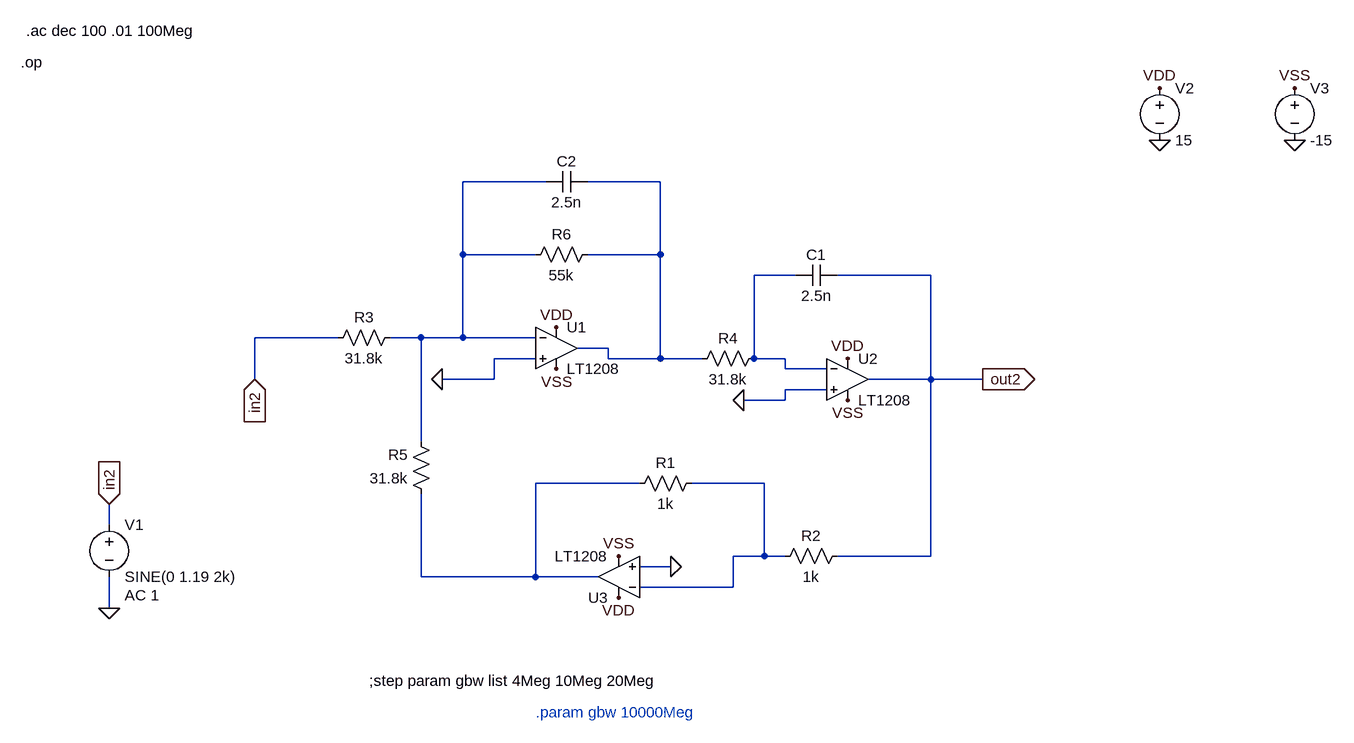
[diagram p0: schematic Etaj2.asc]
Etaj2.asc, the LTspice schematic file:
Version 4
SHEET 1 1236 680
WIRE 16 -256 -112 -256
WIRE 192 -256 80 -256
WIRE -112 -144 -112 -256
WIRE 0 -144 -112 -144
WIRE 192 -144 192 -256
WIRE 192 -144 80 -144
WIRE 400 -112 336 -112
WIRE 608 -112 464 -112
WIRE -304 -16 -432 -16
WIRE -176 -16 -224 -16
WIRE -112 -16 -112 -144
WIRE -112 -16 -176 -16
WIRE 0 -16 -112 -16
WIRE 112 0 64 0
WIRE 0 16 -64 16
WIRE 112 16 112 0
WIRE 192 16 192 -144
WIRE 192 16 112 16
WIRE 256 16 192 16
WIRE 336 16 336 -112
WIRE 384 16 336 16
WIRE 384 32 384 16
WIRE 448 32 384 32
WIRE -432 48 -432 -16
WIRE -64 48 -64 16
WIRE -64 48 -144 48
WIRE 608 48 608 -112
WIRE 608 48 512 48
WIRE 688 48 608 48
WIRE 448 64 384 64
WIRE 384 80 384 64
WIRE 384 80 320 80
WIRE -176 144 -176 -16
WIRE 160 208 0 208
WIRE 352 208 240 208
WIRE -656 272 -656 240
WIRE 352 320 352 208
WIRE 352 320 304 320
WIRE 384 320 352 320
WIRE 608 320 608 48
WIRE 608 320 464 320
WIRE 208 336 160 336
WIRE -176 352 -176 224
WIRE 0 352 0 208
WIRE 0 352 -176 352
WIRE 96 352 0 352
WIRE 304 368 304 320
WIRE 304 368 160 368
WIRE -656 400 -656 352
FLAG -144 48 0
FLAG 320 80 0
FLAG 128 320 VSS
FLAG 128 384 VDD
FLAG 32 -32 VDD
FLAG 480 16 VDD
FLAG 32 32 VSS
FLAG 480 80 VSS
FLAG 208 336 0
FLAG -432 48 in2
IOPIN -432 48 In
FLAG 688 48 out2
IOPIN 688 48 Out
FLAG -656 240 in2
IOPIN -656 240 In
FLAG -656 400 0
FLAG 960 -320 0
FLAG 1168 -320 0
FLAG 960 -400 VDD
FLAG 1168 -400 VSS
SYMBOL cap 464 -128 R90
WINDOW 0 0 32 VBottom 2
WINDOW 3 32 32 VTop 2
SYMATTR InstName C1
SYMATTR Value 2.5n
SYMBOL res 256 192 R90
WINDOW 0 0 56 VBottom 2
WINDOW 3 32 56 VTop 2
SYMATTR InstName R1
SYMATTR Value 1k
SYMBOL res 480 304 R90
WINDOW 0 0 56 VBottom 2
WINDOW 3 32 56 VTop 2
SYMATTR InstName R2
SYMATTR Value 1k
SYMBOL res -208 -32 R90
WINDOW 0 0 56 VBottom 2
WINDOW 3 32 56 VTop 2
SYMATTR InstName R3
SYMATTR Value 31.8k
SYMBOL res 352 0 R90
WINDOW 0 0 56 VBottom 2
WINDOW 3 32 56 VTop 2
SYMATTR InstName R4
SYMATTR Value 31.8k
SYMBOL res -160 240 R180
WINDOW 0 36 76 Left 2
WINDOW 3 36 40 Left 2
SYMATTR InstName R5
SYMATTR Value 31.8k
SYMBOL res 96 -160 R90
WINDOW 0 0 56 VBottom 2
WINDOW 3 32 56 VTop 2
SYMATTR InstName R6
SYMATTR Value 55k
SYMBOL cap 80 -272 R90
WINDOW 0 0 32 VBottom 2
WINDOW 3 32 32 VTop 2
SYMATTR InstName C2
SYMATTR Value 2.5n
SYMBOL OpAmps\\LT1208 32 -64 R0
SYMATTR InstName U1
SYMBOL OpAmps\\LT1208 480 -16 R0
SYMATTR InstName U2
SYMBOL OpAmps\\LT1208 128 416 R180
SYMATTR InstName U3
SYMBOL voltage -656 256 R0
WINDOW 123 24 124 Left 2
WINDOW 39 0 0 Left 0
SYMATTR Value2 AC 1
SYMATTR InstName V1
SYMATTR Value SINE(0 1.19 2k)
SYMBOL voltage 960 -416 R0
WINDOW 123 0 0 Left 0
WINDOW 39 0 0 Left 0
SYMATTR InstName V2
SYMATTR Value 15
SYMBOL voltage 1168 -416 R0
WINDOW 123 0 0 Left 0
WINDOW 39 0 0 Left 0
SYMATTR InstName V3
SYMATTR Value -15
TEXT 0 560 Left 2 ;.param gbw 10000Meg
TEXT -256 512 Left 2 !;step param gbw list 4Meg 10Meg 20Meg
TEXT -784 -488 Left 2 !.ac dec 100 .01 100Meg
TEXT -792 -440 Left 2 !.op

The netlist it stands for:
* Etaj2.asc
C1 out2 N003 2.5n
R1 N005 N004 1k
R2 out2 N005 1k
R3 N001 in2 31.8k
R4 N003 N002 31.8k
R5 N004 N001 31.8k
R6 N002 N001 55k
C2 N002 N001 2.5n
XU1 0 N001 VDD VSS N002 LT1208  ; pins In+ In- V+ V- OUT
XU2 0 N003 VDD VSS out2 LT1208  ; pins In+ In- V+ V- OUT
XU3 0 N005 VDD VSS N004 LT1208  ; pins In+ In- V+ V- OUT
V1 in2 0 SINE(0 1.19 2k) AC 1
V2 VDD 0 15
V3 VSS 0 -15
* .param gbw 10000Meg
;step param gbw list 4Meg 10Meg 20Meg
.ac dec 100 .01 100Meg
.op
.backanno
.end